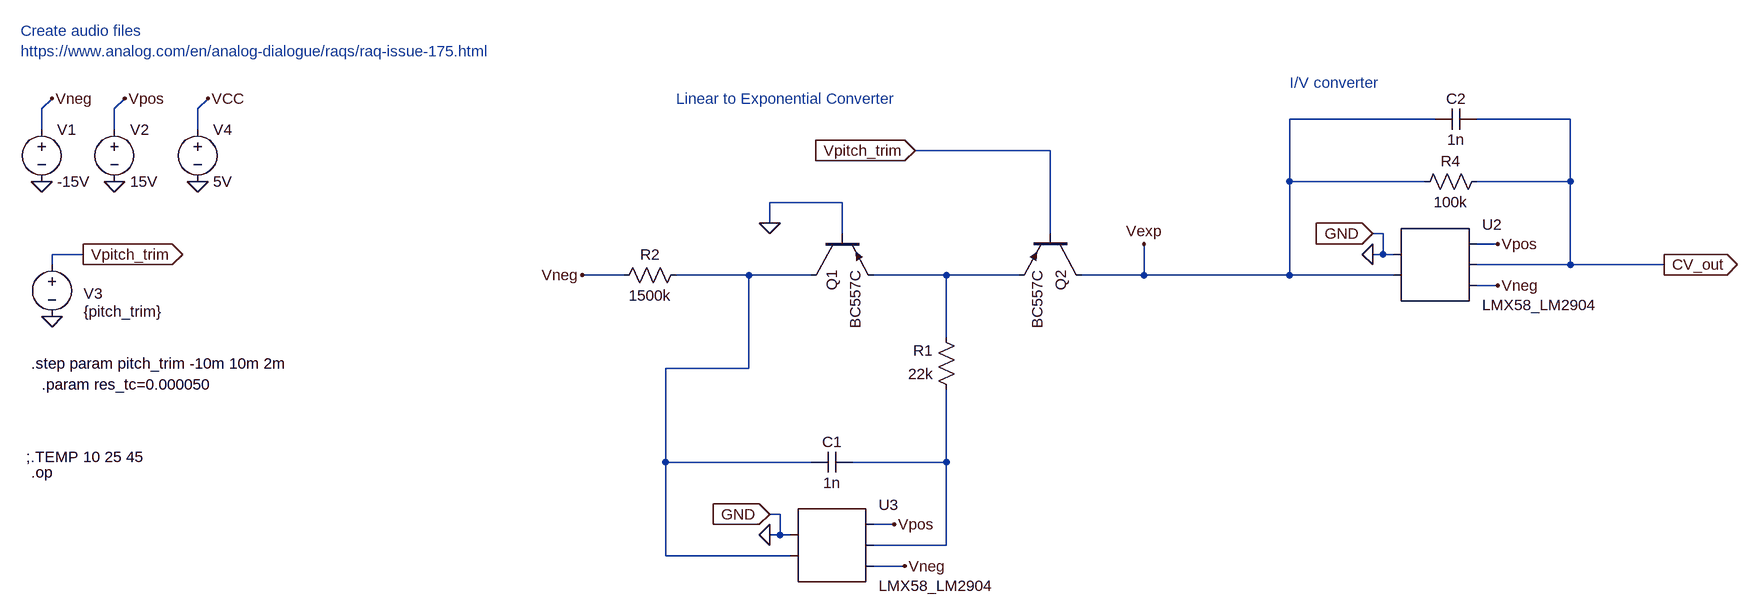
[diagram p0: schematic main_pnpbased_alternative.asc]
main_pnpbased_alternative.asc, the LTspice schematic file:
Version 4
SHEET 1 2332 952
WIRE -1504 -208 -1488 -224
WIRE -1392 -208 -1376 -224
WIRE -1264 -208 -1248 -224
WIRE 640 -192 416 -192
WIRE 848 -192 704 -192
WIRE -1504 -176 -1504 -208
WIRE -1392 -176 -1392 -208
WIRE -1264 -176 -1264 -208
WIRE 48 -144 -160 -144
WIRE 416 -96 416 -192
WIRE 624 -96 416 -96
WIRE 848 -96 848 -192
WIRE 848 -96 704 -96
WIRE -272 -64 -384 -64
WIRE -384 -32 -384 -64
WIRE -272 -16 -272 -64
WIRE 48 -16 48 -144
WIRE 560 -16 544 -16
WIRE 736 0 704 0
WIRE -1440 16 -1488 16
WIRE 560 16 560 -16
WIRE 560 16 544 16
WIRE 576 16 560 16
WIRE -1488 32 -1488 16
WIRE 848 32 848 -96
WIRE 848 32 704 32
WIRE 992 32 848 32
WIRE -608 48 -672 48
WIRE -416 48 -528 48
WIRE -320 48 -416 48
WIRE -112 48 -224 48
WIRE 0 48 -112 48
WIRE 192 48 192 0
WIRE 192 48 96 48
WIRE 416 48 416 -96
WIRE 416 48 192 48
WIRE 576 48 416 48
WIRE 736 64 704 64
WIRE -112 144 -112 48
WIRE -416 192 -416 48
WIRE -416 192 -544 192
WIRE -544 336 -544 192
WIRE -320 336 -544 336
WIRE -112 336 -112 224
WIRE -112 336 -256 336
WIRE -368 416 -384 416
WIRE -192 432 -224 432
WIRE -368 448 -368 416
WIRE -368 448 -384 448
WIRE -352 448 -368 448
WIRE -112 464 -112 336
WIRE -112 464 -224 464
WIRE -544 480 -544 336
WIRE -352 480 -544 480
WIRE -176 496 -224 496
FLAG -1504 -96 0
FLAG -1392 -96 0
FLAG -1488 112 0
FLAG -1488 -224 Vneg
FLAG -1376 -224 Vpos
FLAG -1264 -96 0
FLAG -1248 -224 VCC
FLAG -1440 16 Vpitch_trim
IOPIN -1440 16 Out
FLAG -384 -32 0
FLAG 192 0 Vexp
FLAG -672 48 Vneg
FLAG -160 -144 Vpitch_trim
IOPIN -160 -144 In
FLAG -384 416 GND
IOPIN -384 416 In
FLAG -384 448 0
FLAG -176 496 Vneg
FLAG -192 432 Vpos
FLAG 736 64 Vneg
FLAG 736 0 Vpos
FLAG 544 -16 GND
IOPIN 544 -16 In
FLAG 544 16 0
FLAG 992 32 CV_out
IOPIN 992 32 Out
SYMBOL pnp -320 -16 M90
SYMATTR InstName Q1
SYMATTR Value BC557C
SYMBOL pnp 96 -16 R90
SYMATTR InstName Q2
SYMATTR Value BC557C
SYMBOL res -512 32 R90
WINDOW 0 0 56 VBottom 2
WINDOW 3 32 56 VTop 2
SYMATTR InstName R2
SYMATTR Value 1500k
SYMBOL voltage -1504 -192 R0
WINDOW 123 0 0 Left 0
WINDOW 39 0 0 Left 0
SYMATTR InstName V1
SYMATTR Value -15V
SYMBOL voltage -1392 -192 R0
WINDOW 123 0 0 Left 0
WINDOW 39 0 0 Left 0
SYMATTR InstName V2
SYMATTR Value 15V
SYMBOL voltage -1488 16 R0
WINDOW 0 49 60 Left 2
WINDOW 3 49 88 Left 2
WINDOW 123 0 0 Left 0
WINDOW 39 0 0 Left 0
SYMATTR InstName V3
SYMATTR Value {pitch_trim}
SYMBOL voltage -1264 -192 R0
WINDOW 123 0 0 Left 0
WINDOW 39 0 0 Left 0
SYMATTR InstName V4
SYMATTR Value 5V
SYMBOL AutoGenerated\\LMX58_LM2904 640 32 R0
SYMATTR InstName U2
SYMBOL AutoGenerated\\LMX58_LM2904 -288 464 R0
SYMATTR InstName U3
SYMBOL res 720 -112 R90
WINDOW 0 0 56 VBottom 2
WINDOW 3 32 56 VTop 2
SYMATTR InstName R4
SYMATTR Value 100k
SYMBOL res -96 240 R180
WINDOW 0 36 76 Left 2
WINDOW 3 36 40 Left 2
SYMATTR InstName R1
SYMATTR Value 22k
SYMBOL cap -256 320 R90
WINDOW 0 0 32 VBottom 2
WINDOW 3 32 32 VTop 2
SYMATTR InstName C1
SYMATTR Value 1n
SYMBOL cap 704 -208 R90
WINDOW 0 0 32 VBottom 2
WINDOW 3 32 32 VTop 2
SYMATTR InstName C2
SYMATTR Value 1n
TEXT -528 -224 Left 2 ;Linear to Exponential Converter
TEXT -1536 -328 Left 2 ;Create audio files\nhttps://www.analog.com/en/analog-dialogue/raqs/raq-issue-175.html
TEXT -1520 184 Left 2 !.step param pitch_trim -10m 10m 2m
TEXT -1528 328 Left 2 !;.TEMP 10 25 45
TEXT -1504 216 Left 2 !.param res_tc=0.000050
TEXT -1520 352 Left 2 !.op
TEXT 416 -248 Left 2 ;I/V converter

The netlist it stands for:
* main_pnpbased_alternative.asc
Q1 N001 0 N002 0 BC557C
Q2 Vexp Vpitch_trim N002 0 BC557C
R2 N001 Vneg 1500k
V1 Vneg 0 -15V
V2 Vpos 0 15V
V3 Vpitch_trim 0 {pitch_trim}
V4 VCC 0 5V
* U2: LMX58_LM2904 (symbol AutoGenerated\LMX58_LM2904 not available, pins judged from their places): pin1=0 pin2=Vexp pin3=Vpos pin4=CV_out pin5=Vneg
* U3: LMX58_LM2904 (symbol AutoGenerated\LMX58_LM2904 not available, pins judged from their places): pin1=0 pin2=N001 pin3=Vpos pin4=N003 pin5=Vneg
R4 CV_out Vexp 100k
R1 N003 N002 22k
C1 N003 N001 1n
C2 CV_out Vexp 1n
.model NPN NPN
.model PNP PNP
.lib standard.bjt
* Linear to Exponential Converter
* Create audio files
* https://www.analog.com/en/analog-dialogue/raqs/raq-issue-175.html
.step param pitch_trim -10m 10m 2m
;.TEMP 10 25 45
.param res_tc=0.000050
.op
* I/V converter
.backanno
.end